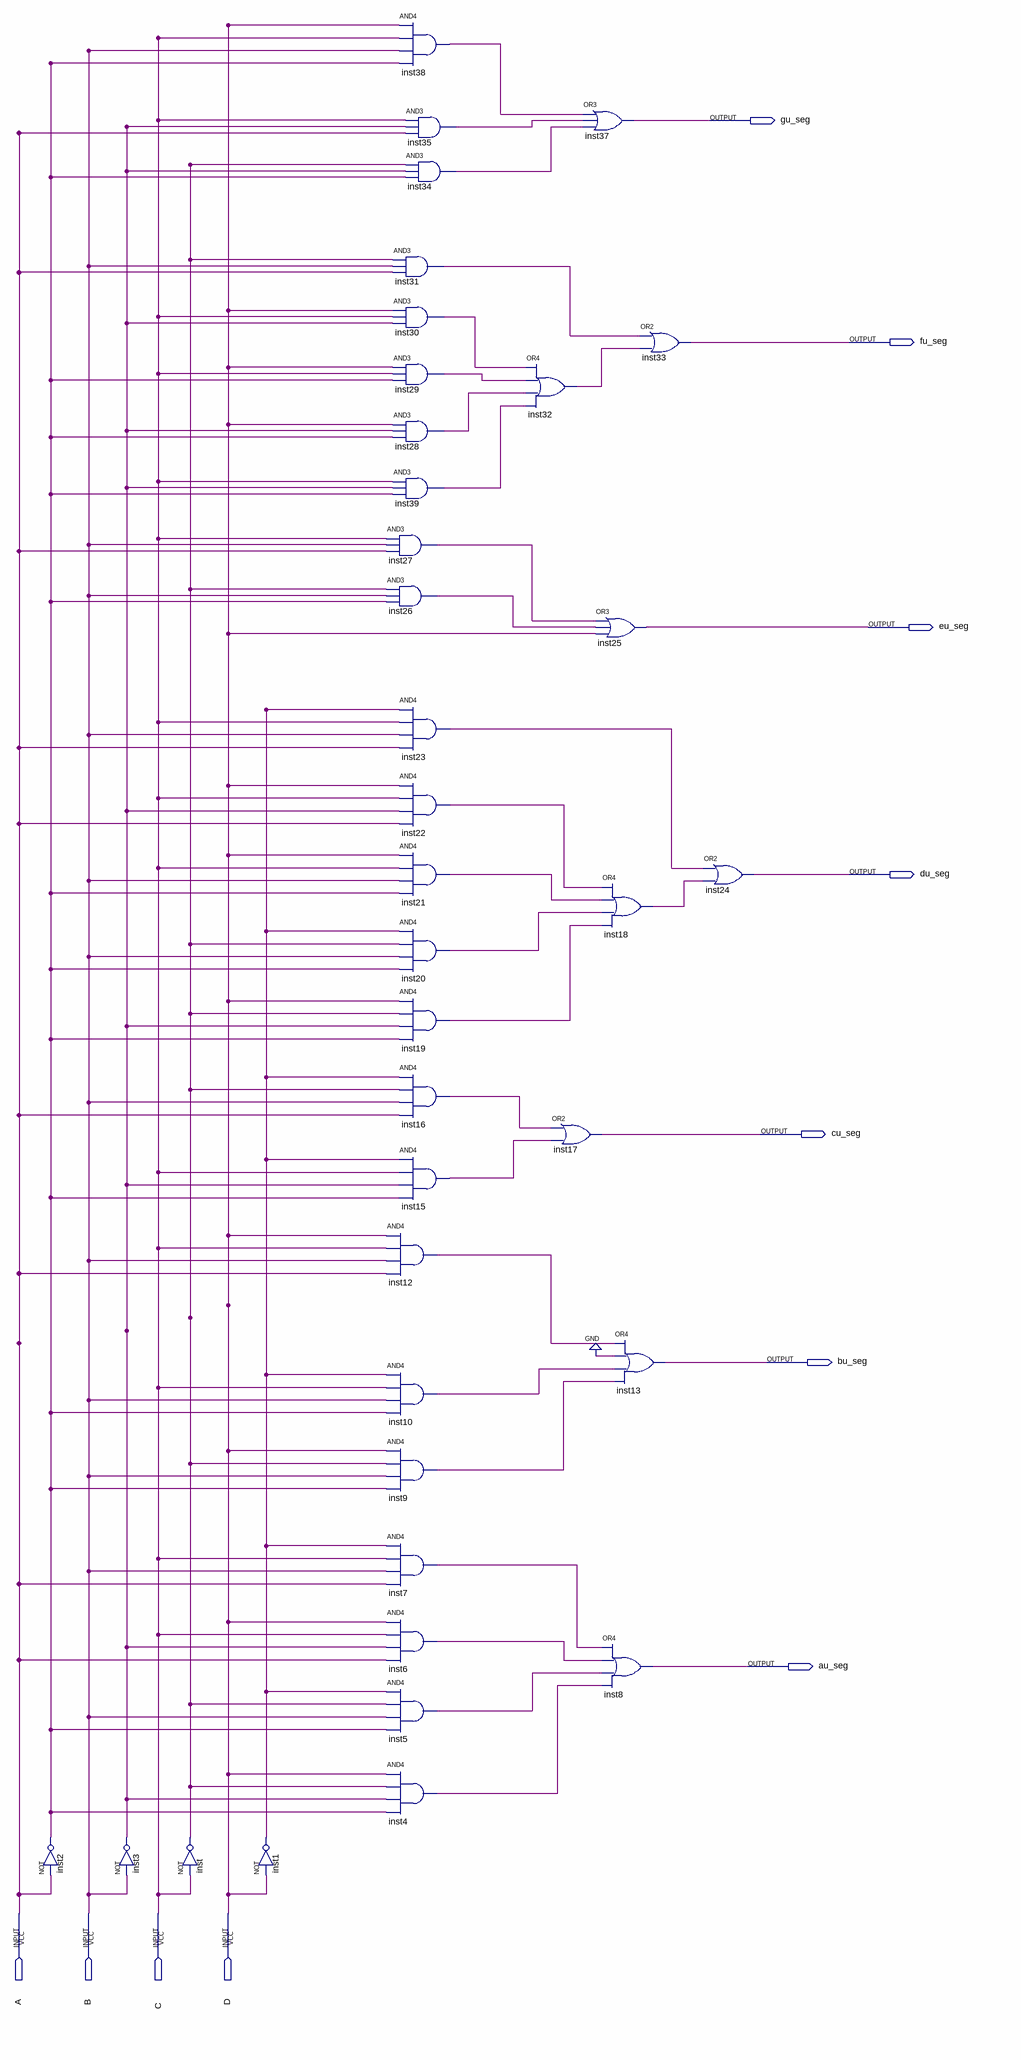
[diagram p0: schematic sheet]
// Quartus schematic decod7seg_ab_unidade.bdf as structural Verilog: 37 symbols, 11 pins
module decod7seg_ab_unidade (
  input  A,
  input  B,
  input  C,
  input  D,
  output gu_seg,
  output fu_seg,
  output eu_seg,
  output du_seg,
  output cu_seg,
  output bu_seg,
  output au_seg
);

  wire inst1_out, inst2_out, inst3_out, inst4_out, inst5_out, inst6_out, inst7_out, inst9_out, inst10_out,
       inst12_out, inst15_out, inst16_out, inst18_out, inst19_out, inst20_out, inst21_out, inst22_out,
       inst23_out, inst26_out, inst27_out, inst28_out, inst29_out, inst30_out, inst31_out, inst32_out,
       inst34_out, inst35_out, inst38_out, inst39_out, inst_out;

  not inst2 (inst2_out, A);
  not inst3 (inst3_out, B);
  not inst (inst_out, C);
  not inst1 (inst1_out, D);
  and inst38 (inst38_out, D, C, B, inst2_out);
  and inst35 (inst35_out, C, inst3_out, A);
  and inst34 (inst34_out, inst_out, inst3_out, inst2_out);
  and inst31 (inst31_out, inst_out, B, A);
  and inst30 (inst30_out, D, C, inst3_out);
  and inst29 (inst29_out, D, C, inst2_out);
  and inst28 (inst28_out, D, inst3_out, inst2_out);
  and inst39 (inst39_out, C, inst3_out, inst2_out);
  and inst27 (inst27_out, C, B, A);
  and inst26 (inst26_out, inst_out, B, inst2_out);
  and inst23 (inst23_out, inst1_out, C, B, A);
  and inst22 (inst22_out, D, C, inst3_out, A);
  and inst21 (inst21_out, D, C, B, inst2_out);
  and inst20 (inst20_out, inst1_out, inst_out, B, inst2_out);
  and inst19 (inst19_out, D, inst_out, inst3_out, inst2_out);
  and inst16 (inst16_out, inst1_out, inst_out, B, A);
  and inst15 (inst15_out, inst1_out, C, inst3_out, inst2_out);
  and inst12 (inst12_out, D, C, B, A);
  and inst10 (inst10_out, inst1_out, C, B, inst2_out);
  and inst9 (inst9_out, D, inst_out, B, inst2_out);
  and inst7 (inst7_out, inst1_out, C, B, A);
  and inst6 (inst6_out, D, C, inst3_out, A);
  and inst5 (inst5_out, inst1_out, inst_out, B, inst2_out);
  and inst4 (inst4_out, D, inst_out, inst3_out, inst2_out);
  or inst32 (inst32_out, inst30_out, inst29_out, inst28_out, inst39_out);
  or inst17 (cu_seg, inst16_out, inst15_out);
  or inst37 (gu_seg, inst38_out, inst35_out, inst34_out);
  or inst25 (eu_seg, inst27_out, inst26_out, D);
  or inst18 (inst18_out, inst22_out, inst21_out, inst20_out, inst19_out);
  or inst13 (bu_seg, inst12_out, 1'b0, inst10_out, inst9_out);
  or inst8 (au_seg, inst7_out, inst6_out, inst5_out, inst4_out);
  or inst33 (fu_seg, inst31_out, inst32_out);
  or inst24 (du_seg, inst23_out, inst18_out);
endmodule
